# Altium schematic sheet RFSwitchAnt.SchDoc: RF Switch (GPS or Iridium Modem)
size 431 x 279 mm; DocumentNumber: 16; SheetNumber: 16; SheetTotal: 18; ENG_APP_DATE: --/--/--; DSN_APP_DATE: --/--/--; CHK_APP_DATE: --/--/--
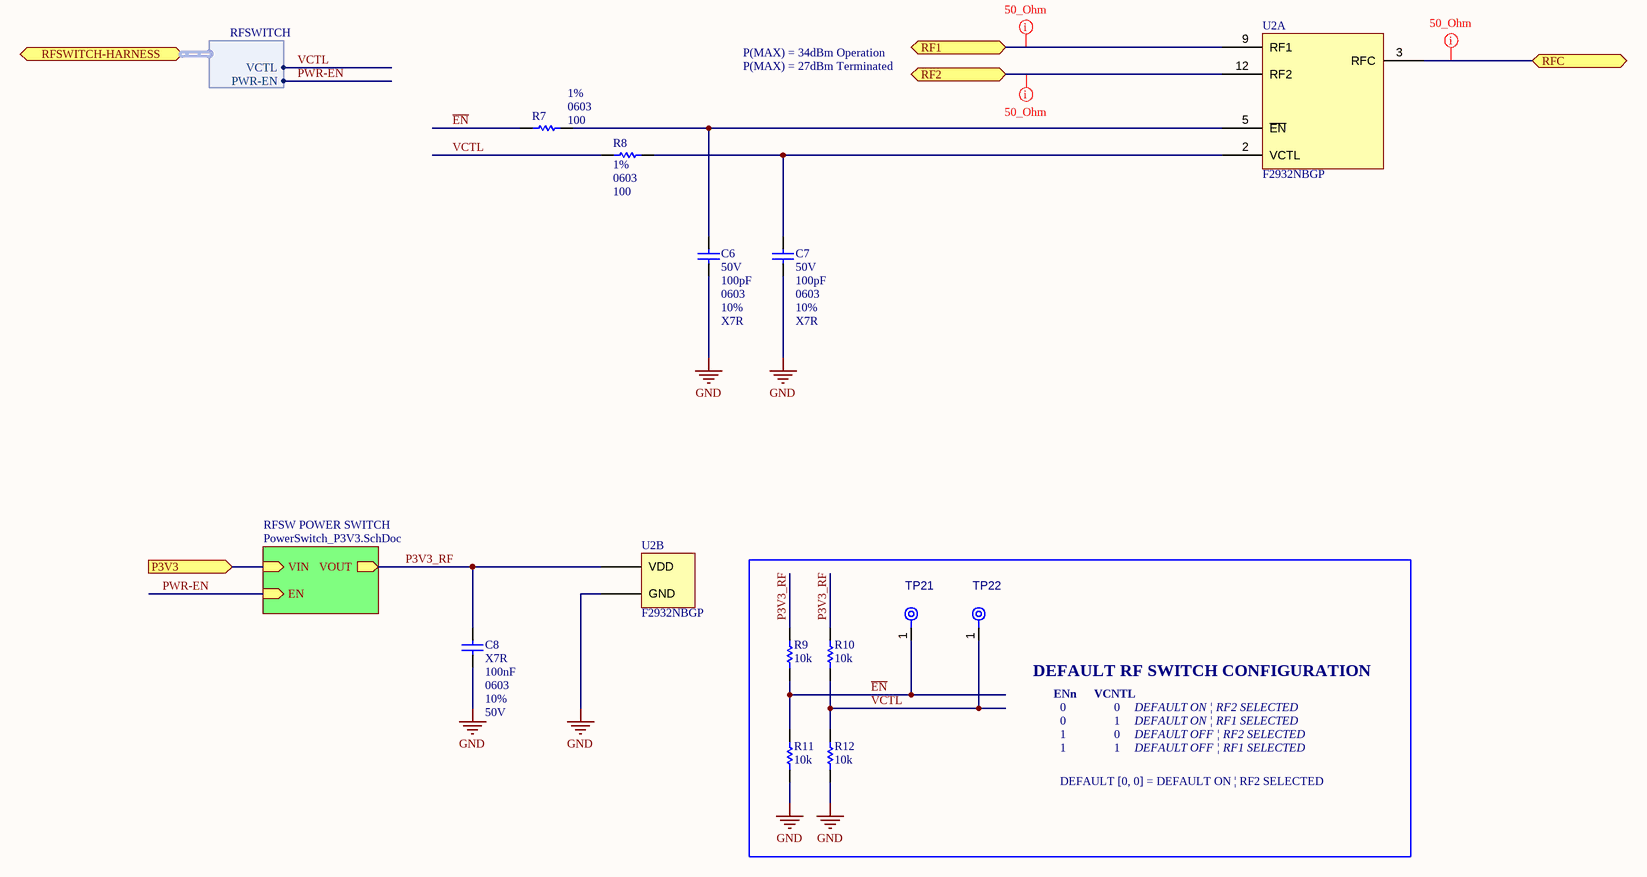
[diagram p0: RFSwitchAnt.SchDoc]

## Parts
C6  value 100pF  Voltage Rating: 50V  Case/Package: 0603  Tolerance: 10%  Dielectric: X7R  [CAPC1608X90X40ML10T20]  (hidden comment: Capacitor 100pF +/- 10%, 50V, X7R, 0603)
C7  value 100pF  Voltage Rating: 50V  Case/Package: 0603  Tolerance: 10%  Dielectric: X7R  [CAPC1608X90X40ML10T20]  (hidden comment: Capacitor 100pF +/- 10%, 50V, X7R, 0603)
C8  value 100nF  Dielectric: X7R  Case/Package: 0603  Tolerance: 10%  Voltage Rating: 50V  [CAPC1608X90X40ML10T20]  (hidden comment: Capacitor 100nF +/- 10%, 50V, X7R, 0603)
R7  value 100  Tolerance: 1%  Case/Package: 0603  [RESC1609X50X30ML08T20]  (hidden comment: Resistor 100R +/-1% 0603 100 mW)
R8  value 100  Tolerance: 1%  Case/Package: 0603  [RESC1609X50X30ML08T20]  (hidden comment: Resistor 100R +/-1% 0603 100 mW)
R9  value 10k  [RESC1608X55X25ML10T15]  (hidden comment: Resistor 10k +/-1% 0603 100 mW)
R10  value 10k  [RESC1608X55X25ML10T15]  (hidden comment: Resistor 10k +/-1% 0603 100 mW)
R11  value 10k  [RESC1608X55X25ML10T15]  (hidden comment: Resistor 10k +/-1% 0603 100 mW)
R12  value 10k  [RESC1608X55X25ML10T15]  (hidden comment: Resistor 10k +/-1% 0603 100 mW)
TP21  TPAD6R-CIRCLED  [TP06R - Circled]  (value not drawn)  (no BOM)
TP22  TPAD6R-CIRCLED  [TP06R - Circled]  (value not drawn)  (no BOM)
U2  F2932NBGP  [QFN65P400X400X100_HS-17M]  (parts A,B of 2)

## Blocks framed on the sheet
DEFAULT RF SWITCH CONFIGURATION: R9-R12 TP21 TP22

## Sub-sheets
RFSW POWER SWITCH = PowerSwitch_P3V3.SchDoc: VOUT (out), VIN (in), EN (in)

## Ports
P3V3 (in), RF1 (bidir), RF2 (bidir), RFC (bidir), RFSWITCH-HARNESS (bidir, harness RFSWITCH)

## Harnesses
RFSWITCH: PWR-EN, VCTL

## Nets
GND: C6.1 C7.1 C8.1 R11.1 R12.1 U2.4(GND)
~{EN}: R7.2 R9.1 R11.2 TP21.1(TP)
P3V3: port P3V3, sheet RFSW POWER SWITCH/VIN
P3V3_RF: C8.2 R9.2 R10.2 U2.1(VDD) ; sheet RFSW POWER SWITCH/VOUT
PWR-EN: sheet RFSW POWER SWITCH/EN, port RFSWITCH-HARNESS.PWR-EN
RF1: U2.9(RF1) ; port RF1
RF2: U2.12(RF2) ; port RF2
RFC: U2.3(RFC) ; port RFC
VCTL: R8.2 R10.1 R12.2 TP22.1(TP) ; port RFSWITCH-HARNESS.VCTL
NetC6_2: C6.2 R7.1 U2.5(~{EN})
NetC7_2: C7.2 R8.1 U2.2(VCTL)

## Layout directives
net class 50_Ohm: RF1, RF2, RFC

## Notes on the sheet
- P(MAX) = 34dBm Operation
- P(MAX) = 27dBm Terminated
- ENn
- VCNTL
- 0
- 1
- DEFAULT ON | RF2 SELECTED
- DEFAULT ON | RF1 SELECTED
- DEFAULT OFF | RF2 SELECTED
- DEFAULT OFF | RF1 SELECTED
- DEFAULT [0, 0] = DEFAULT ON | RF2 SELECTED
- THIS DOCUMENT AND THE DATA DISCLOSED HEREIN OR HEREWITH IS THE PROPERTY OF APPLIED PHYSICS LAB - UNIVERSITY OF WASHINGTON.
- PROJECT
- TITLE
- FILE NAME
- SIZE
- B
- CAGE CODE
- DWG NO.
- SHEET
- OF
- REV

## Library data of the parts
C6 C7 = CMP-001-00188-10: Chip Capacitor, 100pF, +/- 10%, 50 V, X7R 0603 (1608 Metric); Capacitor Type: Ceramic; Max Operating Temperature: 125°C; Capacitance: 100pF; RoHS Compliant: True; Min Operating Temperature: -55°C; Pins: 2; Decade: 100pF; Mount: Surface Mount
C8 = CMP-001-00206-10: Chip Capacitor, 100nF, +/- 10%, 50 V, X7R 0603 (1608 Metric); Capacitor Type: Ceramic; Pins: 2; RoHS Compliant: True; Max Operating Temperature: 125°C; Capacitance: 100nF; Min Operating Temperature: -55°C; Decade: 100nF; Mount: Surface Mount
R7 R8 = CMP-009-01066-3: Chip Resistor, 100 Ohm, +/- 1%, 0.1 W, -55 to 155 degC, 0603 (1608 Metric); Power: 100mW; Voltage Rating: 75V; Decade: 100; Min Operating Temperature: -55°C; Max Operating Temperature: 155°C; Pins: 2; RoHS Compliant: Yes; Mount: Surface Mount
R9-R12 = CMP-009-00017-8: Chip Resistor, 10 KOhm, +/- 1%, 01 W, -55 to 155 degC, 0603 (1608 Metric); Voltage Rating: 50V; Power: 100mW; RoHS Compliant: True; Max Operating Temperature: 155°C; Tolerance: 1%; Min Operating Temperature: -55°C; Case/Package: 0603; Pins: 2; Decade: 10k; Mount: Surface Mount
TP21 TP22 = CMP-00028-00014-3: 0.6mm round with a silkscreen circle.; Pins: 1
U2 = CMP-021-00008-9: High Reliability SP2T Absorptive RF Switch; pin to pad: 4>4+6+7+8+10+11+13+14+15+16+17; Throw Configuration: SPDT; Insertion Loss: 1.6dB; Impedance: 50R; P1dB: 35.3dBm; IIP3: 64dBm; Case/Package: VQFN; Min Operating Temperature: -40°C; Max Operating Temperature: 105°C; Mount: Surface Mount